# Altium schematic sheet schematic.SchDoc
size A4; SheetNumber: 1; SheetTotal: 1
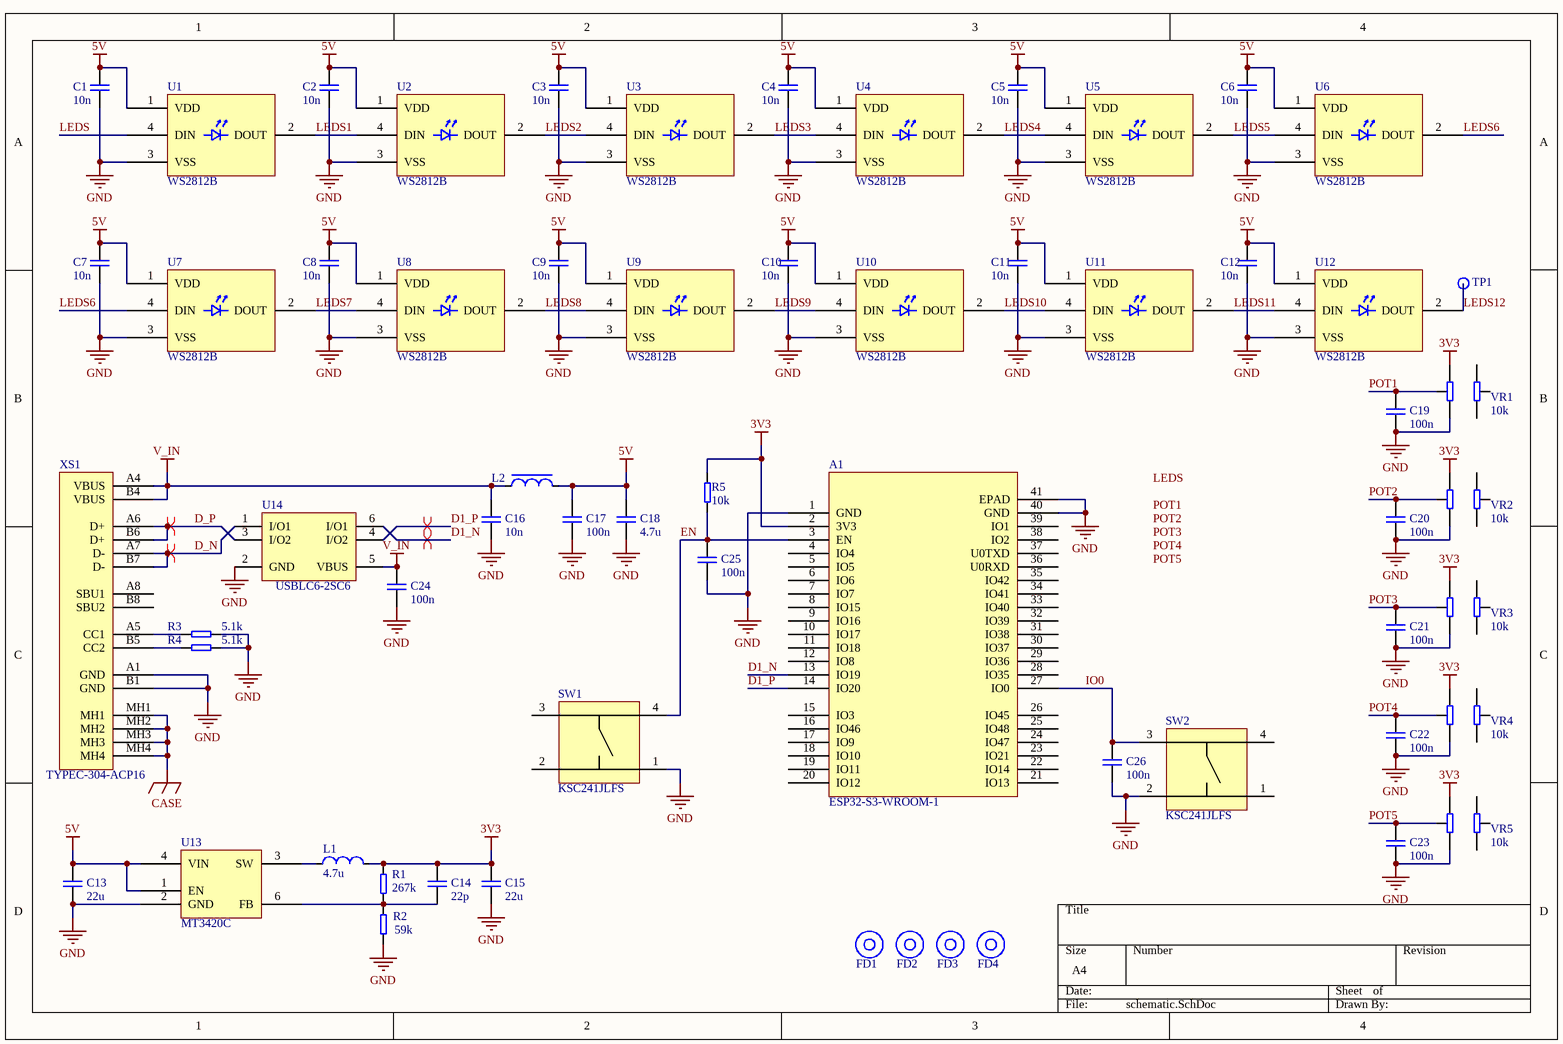
[diagram p0: schematic.SchDoc]

## Parts
A1  ESP32-S3-WROOM-1  [ESP32-S3-WROOM-1]
C1  10n  [C0805]
C2  10n  [C0805]
C3  10n  [C0805]
C4  10n  [C0805]
C5  10n  [C0805]
C6  10n  [C0805]
C7  10n  [C0805]
C8  10n  [C0805]
C9  10n  [C0805]
C10  10n  [C0805]
C11  10n  [C0805]
C12  10n  [C0805]
C13  22u  [C1210]
C14  22p  [C0805]
C15  22u  [C1210]
C16  10n  [C0805]
C17  100n  [C0805]
C18  4.7u  [C0805]
C19  100n  [C0805]
C20  100n  [C0805]
C21  100n  [C0805]
C22  100n  [C0805]
C23  100n  [C0805]
C24  100n  [C0805]
C25  100n  [C0805]
C26  100n  [C0805]
FD1  Fiducial  [Fiducial]  (value not drawn)  (no BOM)
FD2  Fiducial  [Fiducial]  (value not drawn)  (no BOM)
FD3  Fiducial  [Fiducial]  (value not drawn)  (no BOM)
FD4  Fiducial  [Fiducial]  (value not drawn)  (no BOM)
L1  4.7u  [ASPI-0630LR-4R7]
L2  (no value)  [C0805]
R1  267k  [R0805]
R2  59k  [R0805]
R3  5.1k  [R0805]
R4  5.1k  [R0805]
R5  10k  [R0805]
SW1  KSC241JLFS  [KSC241JLFS]
SW2  KSC241JLFS  [KSC241JLFS]
TP1  Test Point  [Test-Point]  (value not drawn)  (no BOM)
U1  WS2812B  [WS2812B]
U2  WS2812B  [WS2812B]
U3  WS2812B  [WS2812B]
U4  WS2812B  [WS2812B]
U5  WS2812B  [WS2812B]
U6  WS2812B  [WS2812B]
U7  WS2812B  [WS2812B]
U8  WS2812B  [WS2812B]
U9  WS2812B  [WS2812B]
U10  WS2812B  [WS2812B]
U11  WS2812B  [WS2812B]
U12  WS2812B  [WS2812B]
U13  MT3420C  [SOT23-6-MT3420C]
U14  USBLC6-2SC6  [SOT23-6L-USBLC6-2SC6]
VR1  10k  [SC6080GH]
VR2  10k  [SC6080GH]
VR3  10k  [SC6080GH]
VR4  10k  [SC6080GH]
VR5  10k  [SC6080GH]
XS1  TYPEC-304-ACP16  [XUNPU_TYPEC-304-ACP16]

## Nets
3V3: A1.2(3V3) C14.2 C15.2 L1.2 R1.2 R5.1 VR1.1 VR2.1 VR3.1 VR4.1 VR5.1
5V: C1.2 C2.2 C3.2 C4.2 C5.2 C6.2 C7.2 C8.2 C9.2 C10.2 C11.2 C12.2 C13.2 C17.2 C18.2 L2.2 U1.1(VDD) U2.1(VDD) U3.1(VDD) U4.1(VDD) U5.1(VDD) U6.1(VDD) U7.1(VDD) U8.1(VDD) U9.1(VDD) U10.1(VDD) U11.1(VDD) U12.1(VDD) U13.1(EN) U13.4(VIN)
CASE: XS1.MH1 XS1.MH2 XS1.MH3 XS1.MH4
GND: A1.1(GND) A1.40(GND) A1.41(EPAD) C1.1 C2.1 C3.1 C4.1 C5.1 C6.1 C7.1 C8.1 C9.1 C10.1 C11.1 C12.1 C13.1 C15.1 C16.1 C17.1 C18.1 C19.2 C20.2 C21.2 C22.2 C23.2 C24.1 C25.1 C26.1 R2.1 R3.1 R4.1 SW1.1 SW2.2 U1.3(VSS) U2.3(VSS) U3.3(VSS) U4.3(VSS) U5.3(VSS) U6.3(VSS) U7.3(VSS) U8.3(VSS) U9.3(VSS) U10.3(VSS) U11.3(VSS) U12.3(VSS) U13.2(GND) U14.2(GND) VR1.3 VR2.3 VR3.3 VR4.3 VR5.3 XS1.A1(GND) XS1.B1(GND)
V_IN: C16.2 C24.2 L2.1 U14.5(VBUS) XS1.A4(VBUS) XS1.B4(VBUS)
D1_N: A1.13(IO19) U14.6(I/O1)
D1_P: A1.14(IO20) U14.4(I/O2)
D_N: U14.1(I/O1) XS1.A7(D-) XS1.B7(D-)
D_P: U14.3(I/O2) XS1.A6(D+) XS1.B6(D+)
EN: A1.3(EN) C25.2 R5.2 SW1.4
IO0: A1.27(IO0) C26.2 SW2.3
LEDS: U1.4(DIN)
LEDS1: U1.2(DOUT) U2.4(DIN)
LEDS2: U2.2(DOUT) U3.4(DIN)
LEDS3: U3.2(DOUT) U4.4(DIN)
LEDS4: U4.2(DOUT) U5.4(DIN)
LEDS5: U5.2(DOUT) U6.4(DIN)
LEDS6: U6.2(DOUT) U7.4(DIN)
LEDS7: U7.2(DOUT) U8.4(DIN)
LEDS8: U8.2(DOUT) U9.4(DIN)
LEDS9: U9.2(DOUT) U10.4(DIN)
LEDS10: U10.2(DOUT) U11.4(DIN)
LEDS11: U11.2(DOUT) U12.4(DIN)
LEDS12: TP1.0 U12.2(DOUT)
POT1: C19.1 VR1.2
POT2: C20.1 VR2.2
POT3: C21.1 VR3.2
POT4: C22.1 VR4.2
POT5: C23.1 VR5.2
NetC14_1: C14.1 R1.1 R2.2 U13.6(FB)
NetL1_1: L1.1 U13.3(SW)
NetR3_2: R3.2 XS1.A5(CC1)
NetR4_2: R4.2 XS1.B5(CC2)

Not connected (* = marked no-connect by the designer): A1 4(IO4) 5(IO5) 6(IO6) 7(IO7) 8(IO15) 9(IO16) 10(IO17) 11(IO18) 12(IO8) 15(IO3) 16(IO46) 17(IO9) 18(IO10) 19(IO11) 20(IO12) 21(IO13) 22(IO14) 23(IO21) 24(IO47) 25(IO48) 26(IO45) 28(IO35) 29(IO36) 30(IO37) 31(IO38) 32(IO39) 33(IO40) 34(IO41) 35(IO42) 36(U0RXD) 37(U0TXD) 38(IO2) 39(IO1); FD1 1; FD2 1; FD3 1; FD4 1; SW1 2 3; SW2 1 4; VR1 1' 2' 3'; VR2 1' 2' 3'; VR3 1' 2' 3'; VR4 1' 2' 3'; VR5 1' 2' 3'; XS1 A8(SBU1) B8(SBU2)

## Layout directives
differential pair: D1_N, D1_P, D_N, D_P

## Notes on the sheet
- Labels drawn without touching a wire or pin: LEDS, POT1, POT2, POT3, POT4, POT5

## Library data of the parts
A1 = ESP32-S3-WROOM-1: 2.4 GHz Wi-Fi (802.11 b/g/n) and Bluetooth® 5 (LE) module; Manufacturer: espressif; Datasheet: https://www.espressif.com/sites/default/files/documentation/esp32-s3-wroom-1_wroom-1u_datasheet_en.pdf; P/N: ESP32-S3-WROOM-1
C1-C26 = Cap: CAPACITOR
  C1-C12 C16: Value: 10n
  C13 C15: Value: 22u
  C14: Value: 22p
  C17 C19-C26: Value: 100n
  C18: Value: 4.7u
FD1-FD4 = Fiducial: Fiducial marker
L1 = Ind: INDUCTOR; Value: 4.7u
L2 = Ind: Ferrite Bead; P/N: blm21pg221s
R1-R5 = Res: RESISTOR
  R1: Value: 267k
  R2: Value: 59k
  R3 R4: Value: 5.1k
  R5: Value: 10k
SW1 SW2 = KSC241JLFS: SWITCH TACTILE SPST-NO 50mA @ 32VDC; Manufacturer: C&K; P/N: KSC241JLFS; Datasheet: https://www.ckswitches.com/media/1968/ksc2.pdf
U1-U12 = WS2812B: LED RGB 800kHZ; Manufacturer: Worldsemi; Datasheet: https://cdn-shop.adafruit.com/datasheets/WS2812B.pdf; P/N: WS2812B
U13 = MT3420C: 2A 2.3-6V Input 1.5MHz Synchronous Step-Down Converter; Manufacturer: Aerosemi; Datasheet: https://datasheet.lcsc.com/lcsc/1806041635_XI-AN-Aerosemi-Tech-MT3420C_C181741.pdf; P/N: MT3420C
U14 = USBLC6-2SC6: TVS DIODE 5.25V 17V SOT23-6; Manufacturer: STMicroelectronics; Datasheet: https://www.st.com/content/ccc/resource/technical/document/datasheet/06/1d/48/9c/6c/20/4a/b2/CD00050750.pdf/files/CD00050750.pdf/jcr:content/translations/en.CD00050750.pdf; P/N: USBLC6-2SC6
VR1-VR5 = SC6080GH: Nominal Resistance: 10K / Rated Power: 0.25 (W) / Resistance Tolerance: ±20 (%) / Sliding Noise: Less Than 68m (V) / Resolution: 100 (%) / Zero Resistance: 2 (Ω) / Contact Resistance: 5 (Ω) / Insulation Resistance: 100 (MΩ) / Whole Length: Approx. 75mm/3.0in; P/N: SC6080GH; Value: 10k
XS1 = TYPEC-304-ACP16: USB Type-C Compatible 16-position Right Angle Receptacle; Manufacturer: XUNPU; Datasheet: https://datasheet.lcsc.com/lcsc/2008152133_XUNPU-TYPEC-304S-ACP16_C720630.pdf; P/N: TYPEC-304-ACP16